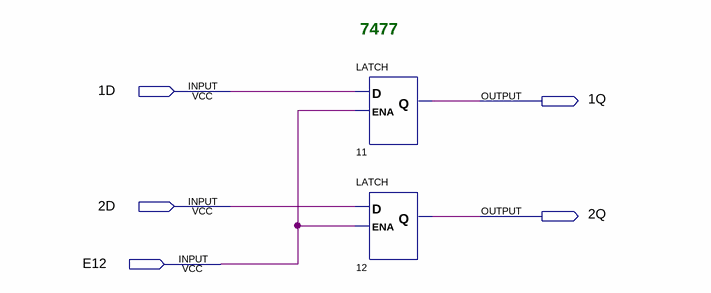
[diagram p0: schematic sheet]
// Quartus schematic LATCH.bdf as structural Verilog: 2 symbols, 5 pins
module LATCH (
  input  \1D ,
  input  \2D ,
  input  E12,
  output \1Q ,
  output \2Q 
);

  LATCH u_11 (.D(\1D ), .ENA(E12), .Q(\1Q ));
  LATCH u_12 (.D(\2D ), .ENA(E12), .Q(\2Q ));

  // Notes on the sheet:
  //   7477
endmodule
